# Altium schematic sheet MIDIInterface.SchDoc
size A3
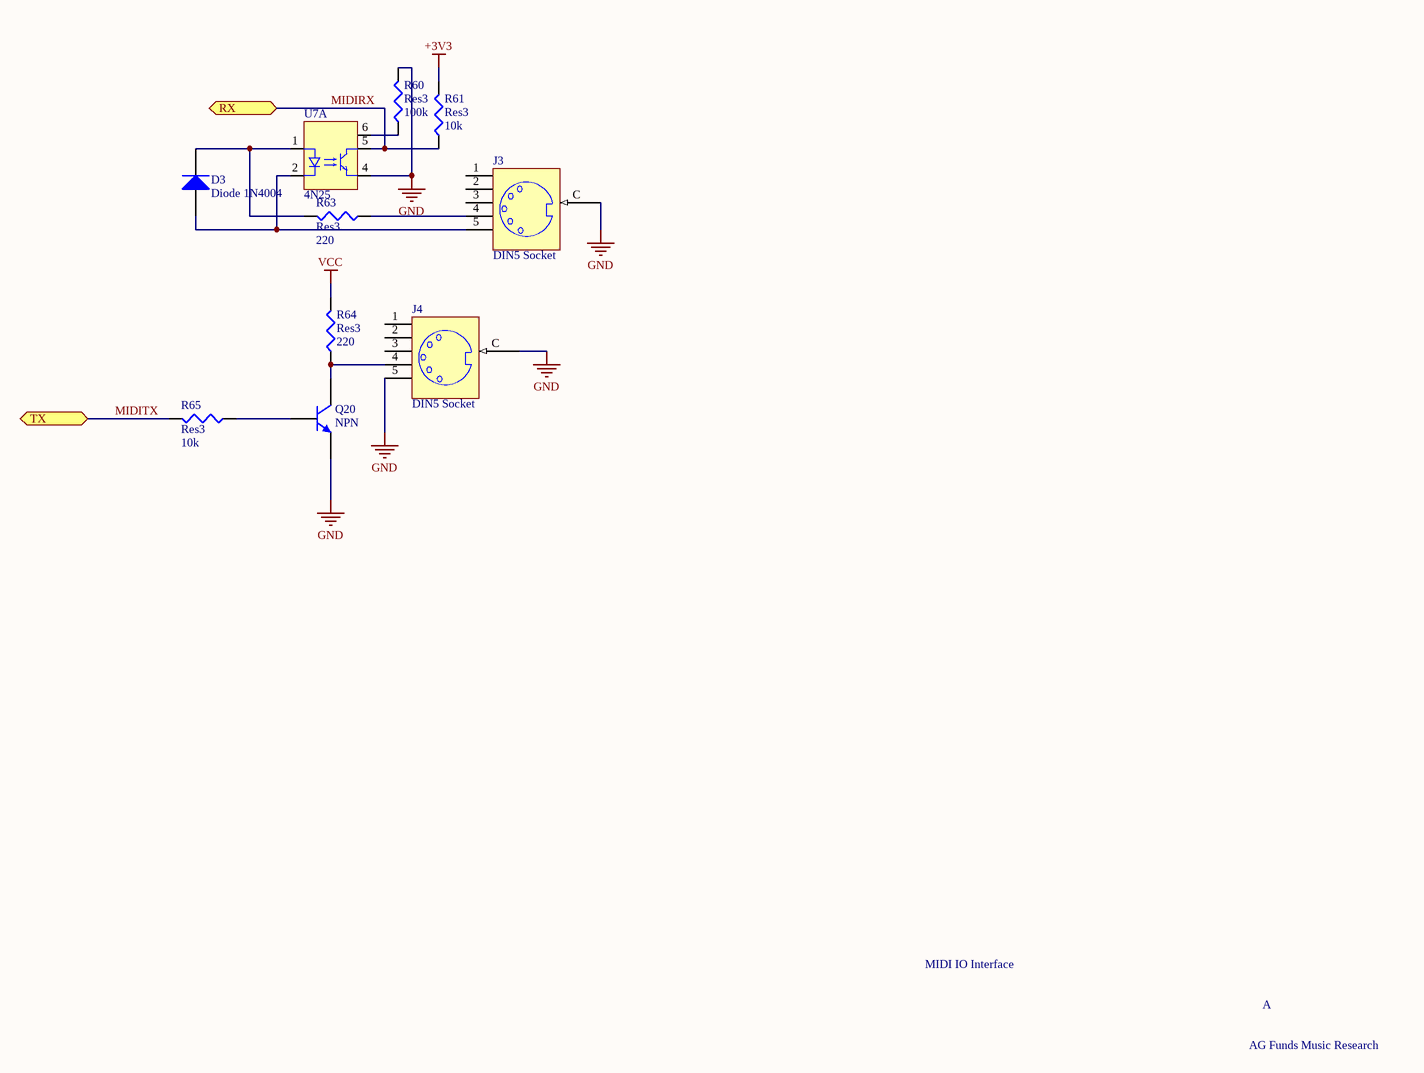
[diagram p0: MIDIInterface.SchDoc]

## Parts
D3  Diode 1N4004  [DO-41]
J3  DIN5 Socket  [DIN-5]
J4  DIN5 Socket  [DIN-5]
Q20  NPN  [SOT95P230-3N]
R60  Res3  value 100k  [J1-0603]
R61  Res3  value 10k  [J1-0603]
R63  Res3  value 220  [J1-0603]
R64  Res3  value 220  [J1-0603]
R65  Res3  value 10k  [J1-0603]
U7  4N25  [DIP-6]  (part A of 2)

## Ports
RX, TX

## Nets
+3V3: R61.2
GND: J3.C J4.5 J4.C Q20.3(E) R60.2 U7.4(E)
VCC: R64.2
MIDIRX: R61.1 U7.5(C) ; port RX
MIDITX: R65.2 ; port TX
NetD3_1: D3.1(A) J3.5 U7.2(K)
NetD3_2: D3.2(K) R63.2 U7.1(A)
NetJ3_4: J3.4 R63.1
NetJ4_4: J4.4 Q20.1(C) R64.1
NetQ20_2: Q20.2(B) R65.1
NetR60_1: R60.1 U7.6(B)

Not connected (* = marked no-connect by the designer): J3 1 2 3; J4 1 2 3

## Notes on the sheet
- MIDI IO Interface
- A
- AG Funds Music Research

## Library data of the parts
D3 = Diode 1N4004: 1 Amp General Purpose Rectifier; Published: 8-Jun-2000; LatestRevisionDate: 17-Jul-2002; LatestRevisionNote: Re-released for DXP Platform.; DatasheetVersion: 1998; PackageVersion: Aug-1999; PackageReference: DO-41; Publisher: Altium Limited; PackageDescription: Diode, Axial; Body 5.2 x 2.7 mm (LxDia. max), Lead Dia. 0.86 mm (max); Code_JEDEC: DO-204-AL; ComponentLink1Description: Manufacturer Link; ComponentLink1URL: http://www.fairchildsemi.com/; ComponentLink2Description: Datasheet; ComponentLink2URL: http://www.fairchildsemi.com/ds/1N%2F1N4001.pdf
J3 J4 = DIN5: CUI Inc. SDS-50J DIN5 PCB Mount Socket; Published: 17-Dec-2003; Publisher: Altium Limited; ComponentLink1Description: Manufacturer Link; ComponentLink1URL: http://www.oupiin.com/prodindx.html#Headers
Q20 = NPN: BC817/BC818 SMD NPN Bipolar Transistor; Published: 8-Jun-2000; LatestRevisionDate: 17-Jul-2002; LatestRevisionNote: Re-released for DXP Platform.; PackageReference: TO-226-AA; Publisher: Altium Limited; PackageDescription: TO, Flat Index; 3 In-Line, Axial Leads; Body Dia. 4.8mm; Leads 0.55 x 0.51 mm (max); Code_JEDEC: TO-226-AA
R60 R61 R63-R65 = Res3: Resistor; Published: 8-Jun-2000; LatestRevisionDate: 29-May-2009; LatestRevisionNote: IPC-7351 Footprint Added.; PackageReference: J1-0603; Publisher: Altium Limited; PackageDescription: Chip Resistor
U7 = 4N25: Optocoupler, Phototransistor Output, Dual Channel, TTL Compatible, Pb-free; Note: Transfer Ratio, 35 % Typical; Published: 6-Oct-2005; DatasheetDocument: Rev. 1.4, Oct-2004; PackageDocument: Dec-2003; PackageReference: DIP8; Publisher: Altium Limited; ComponentLink1Description: Manufacturer Link; ComponentLink1URL: http://www.vishay.com/optocouplers/list/product-83640/; ComponentLink2Description: Datasheet; ComponentLink2URL: http://www.vishay.com/docs/83640/83640.pdf